# Altium schematic sheet 2022_AESK_UAV_Islemci.SchDoc: =ProjectName
size A3; Organization: AESK; Address1: Designed by:; Address3: FATİH CAN; Revision: 2022 v1; SheetNumber: 1; SheetTotal: 6
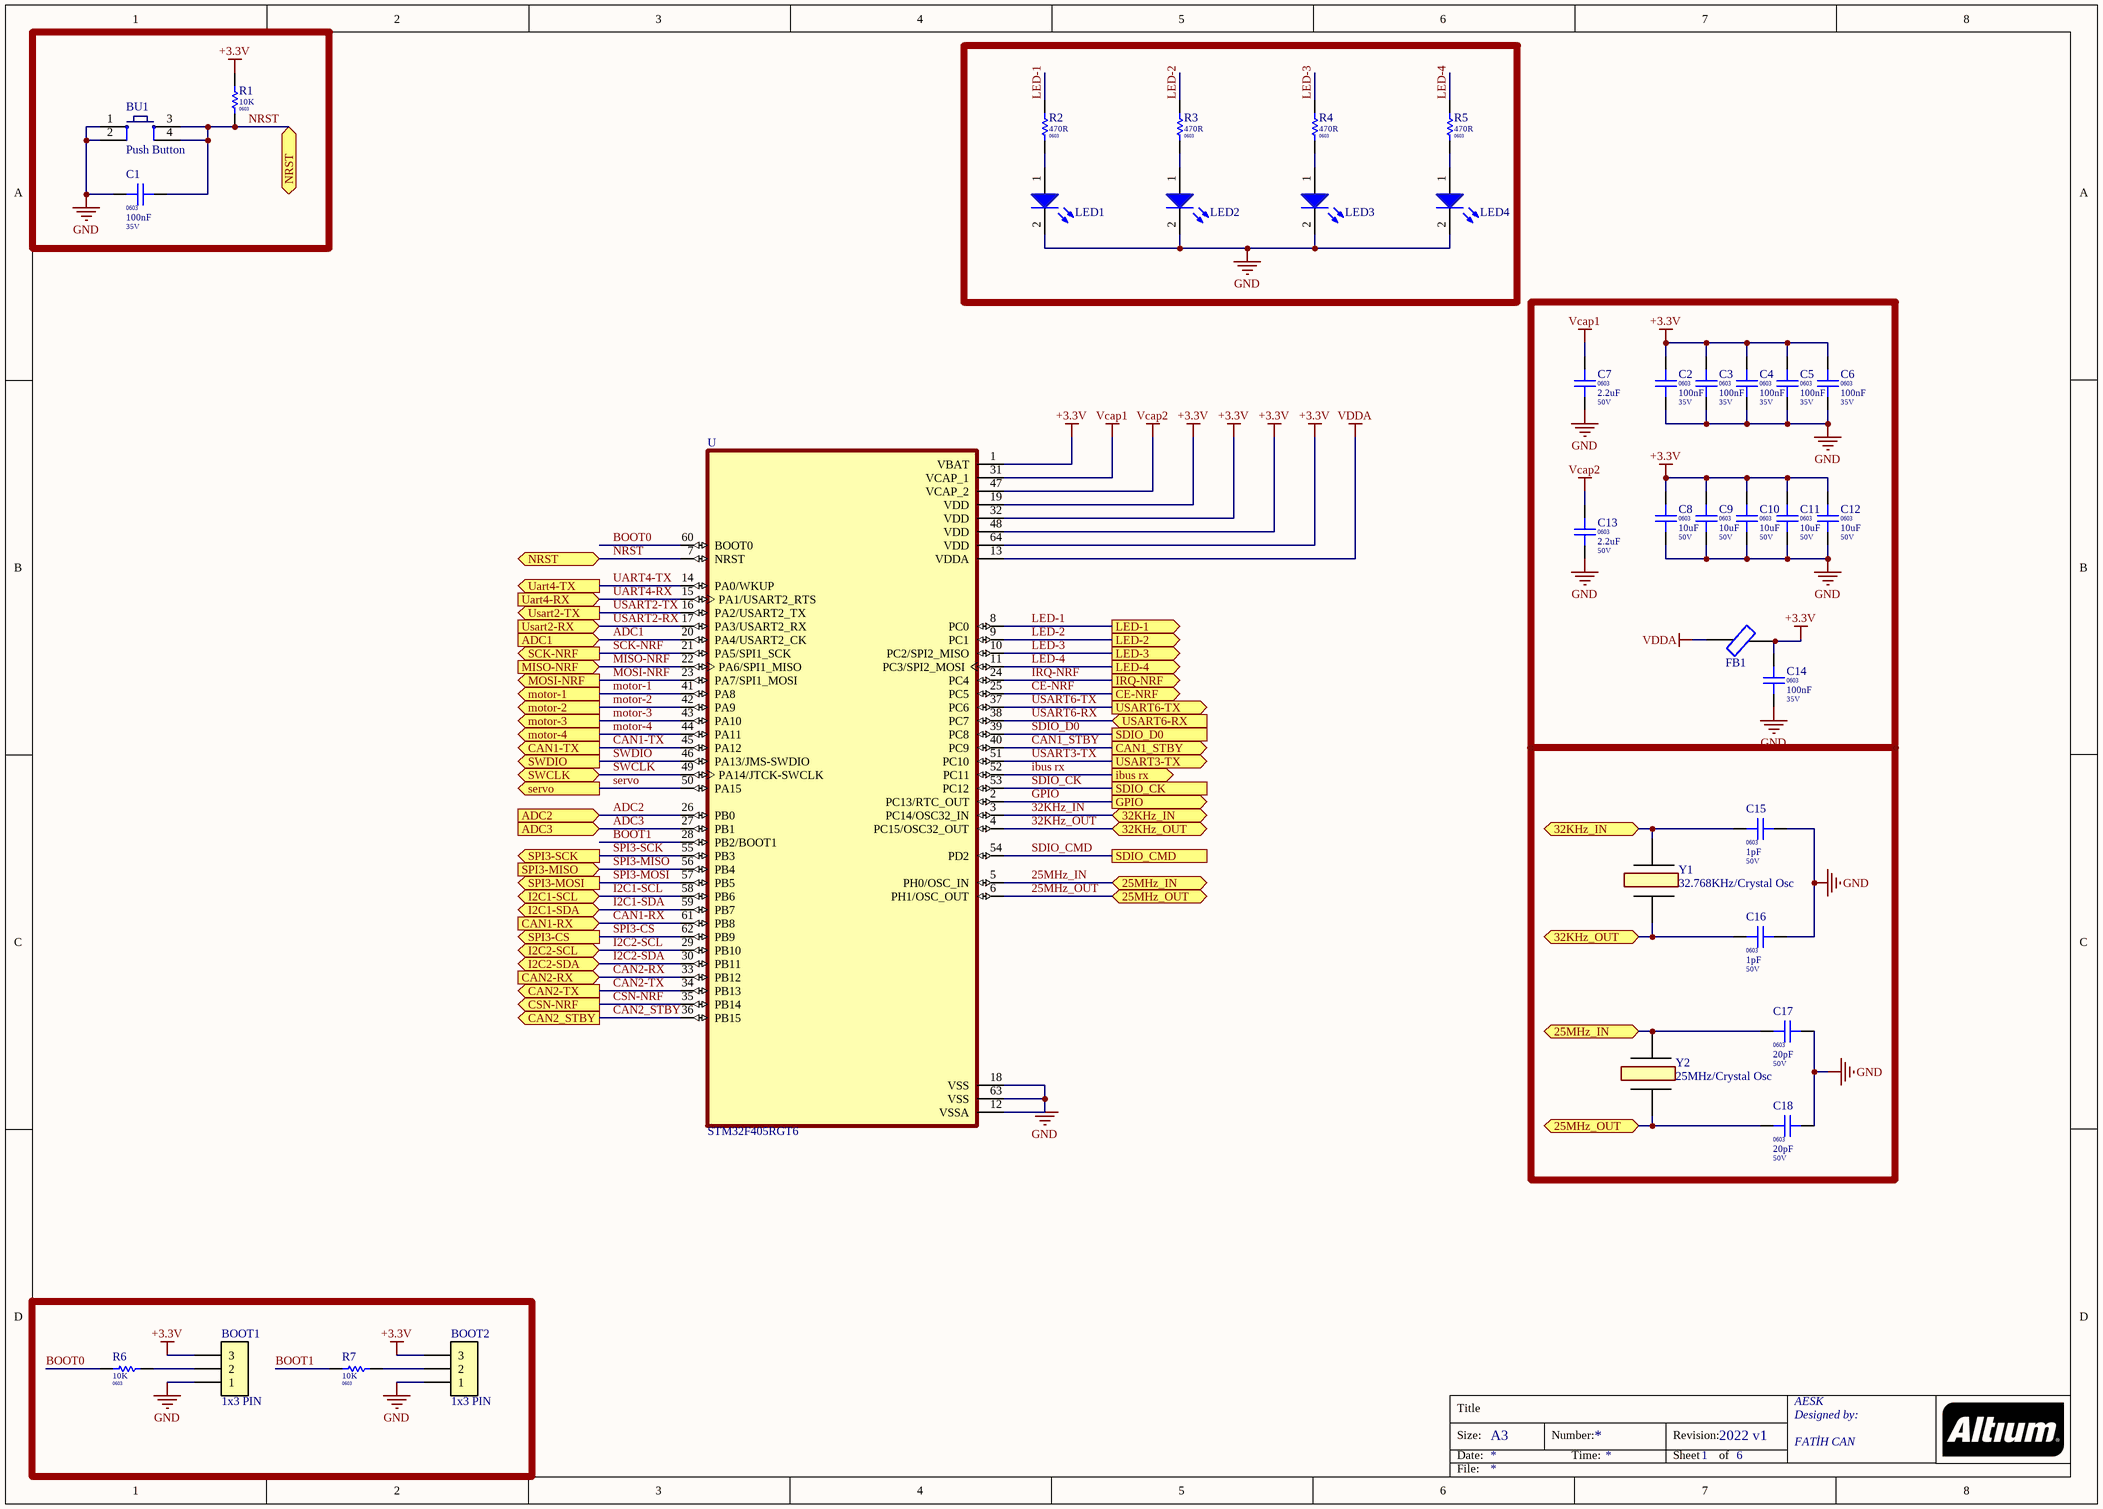
[diagram p0: 2022_AESK_UAV_Islemci.SchDoc]

## Parts
BOOT1  1x3 PIN  [HDR_2.54_1X3]
BOOT2  1x3 PIN  [HDR_2.54_1X3]
BU1  Push Button  [button son]
C1  Package / Case: 0603  Voltage: 35V  [CAPC 0603]  (hidden comment: 100nF)
C2  Package / Case: 0603  Voltage: 35V  [CAPC 0603]  (hidden comment: 100nF)
C3  Package / Case: 0603  Voltage: 35V  [CAPC 0603]  (hidden comment: 100nF)
C4  Package / Case: 0603  Voltage: 35V  [CAPC 0603]  (hidden comment: 100nF)
C5  Package / Case: 0603  Voltage: 35V  [CAPC 0603]  (hidden comment: 100nF)
C6  Package / Case: 0603  Voltage: 35V  [CAPC 0603]  (hidden comment: 100nF)
C7  Package / Case: 0603  Voltage: 50V  [CAPC 0603]  (hidden comment: 2.2uF)
C8  Package / Case: 0603  Voltage: 50V  [CAPC 0603]  (hidden comment: 10uF)
C9  Package / Case: 0603  Voltage: 50V  [CAPC 0603]  (hidden comment: 10uF)
C10  Package / Case: 0603  Voltage: 50V  [CAPC 0603]  (hidden comment: 10uF)
C11  Package / Case: 0603  Voltage: 50V  [CAPC 0603]  (hidden comment: 10uF)
C12  Package / Case: 0603  Voltage: 50V  [CAPC 0603]  (hidden comment: 10uF)
C13  Package / Case: 0603  Voltage: 50V  [CAPC 0603]  (hidden comment: 2.2uF)
C14  Package / Case: 0603  Voltage: 35V  [CAPC 0603]  (hidden comment: 100nF)
C15  Package / Case: 0603  Voltage: 50V  [CAPC 0603]  (hidden comment: 1pF)
C16  Package / Case: 0603  Voltage: 50V  [CAPC 0603]  (hidden comment: 1pF)
C17  Package / Case: 0603  Voltage: 50V  [CAPC 0603]  (hidden comment: 20pF)
C18  Package / Case: 0603  Voltage: 50V  [CAPC 0603]  (hidden comment: 20pF)
FB1  Ferrite Bead  [FCM1608KF-601T03]  (value not drawn)
LED1  (no value)  [LED BLUE 0603]
LED2  (no value)  [LED BLUE 0603]
LED3  (no value)  [LED BLUE 0603]
LED4  (no value)  [LED BLUE 0603]
R1  Package / Case: 0603  [RESC 0603]  (hidden comment: 10K)
R2  Package / Case: 0603  [RESC 0603]  (hidden comment: 470R)
R3  Package / Case: 0603  [RESC 0603]  (hidden comment: 470R)
R4  Package / Case: 0603  [RESC 0603]  (hidden comment: 470R)
R5  Package / Case: 0603  [RESC 0603]  (hidden comment: 470R)
R6  Package / Case: 0603  [RESC 0603]  (hidden comment: 10K)
R7  Package / Case: 0603  [RESC 0603]  (hidden comment: 10K)
U  STM32F405RGT6  [QFP50P1200X1200X160-64N]
Y1  32.768KHz/Crystal Osc  [32KhZ crystal oscillator]
Y2  25MHz/Crystal Osc  [25MHz Crystal Oscillator]

## Ports
25MHz_IN (bidir), 25MHz_OUT (bidir), 32KHz_IN (bidir), 32KHz_OUT (bidir), ADC1 (in), ADC2 (in), ADC3 (in), CAN1-RX (in), CAN1-TX (out), CAN1_STBY (out), CAN2-RX (in), CAN2-TX (out), CAN2_STBY (out), CE-NRF (out), CSN-NRF (out), GPIO (out), I2C1-SCL (bidir), I2C1-SDA (bidir), I2C2-SCL (bidir), I2C2-SDA (bidir), ibus rx (out), IRQ-NRF (out), LED-1 (out), LED-2 (out), LED-3 (out), LED-4 (out), MISO-NRF (in), MOSI-NRF (out), motor-1 (out), motor-2 (out), motor-3 (out), motor-4 (out), NRST (bidir), SCK-NRF (out), SDIO_CK, SDIO_CMD, SDIO_D0, servo (out), SPI3-CS (out), SPI3-MISO (in), SPI3-MOSI (out), SPI3-SCK (out), SWCLK (bidir), SWDIO (out), Uart4-RX (in), Uart4-TX (out), Usart2-RX (in), Usart2-TX (out), USART3-TX (out), USART6-RX (in), USART6-TX (out)

## Nets
+3.3V: BOOT1.3 BOOT2.3 C2.2 C3.2 C4.2 C5.2 C6.2 C8.2 C9.2 C10.2 C11.2 C12.2 C14.2 FB1.2 R1.1 U.1(VBAT) U.19(VDD) U.32(VDD) U.48(VDD) U.64(VDD)
GND: BOOT1.1 BOOT2.1 BU1.1 BU1.2 C1.1 C2.1 C3.1 C4.1 C5.1 C6.1 C7.1 C8.1 C9.1 C10.1 C11.1 C12.1 C13.1 C14.1 C15.2 C16.2 C17.2 C18.2 LED1.2(C) LED2.2(C) LED3.2(C) LED4.2(C) U.12(VSSA) U.18(VSS) U.63(VSS)
Vcap1: C7.2 U.31(VCAP_1)
Vcap2: C13.2 U.47(VCAP_2)
VDDA: FB1.1 U.13(VDDA)
25MHz_IN: C17.1 U.5(PH0/OSC_IN) Y2.2 ; port 25MHz_IN
25MHz_OUT: C18.1 U.6(PH1/OSC_OUT) Y2.1 ; port 25MHz_OUT
32KHz_IN: C15.1 U.3(PC14/OSC32_IN) Y1.2 ; port 32KHz_IN
32KHz_OUT: C16.1 U.4(PC15/OSC32_OUT) Y1.1 ; port 32KHz_OUT
ADC1: U.20(PA4/USART2_CK) ; port ADC1
ADC2: U.26(PB0) ; port ADC2
ADC3: U.27(PB1) ; port ADC3
BOOT0: R6.1 U.60(BOOT0)
BOOT1: R7.1 U.28(PB2/BOOT1)
CAN1-RX: U.61(PB8) ; port CAN1-RX
CAN1-TX: U.45(PA12) ; port CAN1-TX
CAN1_STBY: U.40(PC9) ; port CAN1_STBY
CAN2-RX: U.33(PB12) ; port CAN2-RX
CAN2-TX: U.34(PB13) ; port CAN2-TX
CAN2_STBY: U.36(PB15) ; port CAN2_STBY
CE-NRF: U.25(PC5) ; port CE-NRF
CSN-NRF: U.35(PB14) ; port CSN-NRF
GPIO: U.2(PC13/RTC_OUT) ; port GPIO
I2C1-SCL: U.58(PB6) ; port I2C1-SCL
I2C1-SDA: U.59(PB7) ; port I2C1-SDA
I2C2-SCL: U.29(PB10) ; port I2C2-SCL
I2C2-SDA: U.30(PB11) ; port I2C2-SDA
ibus rx: U.52(PC11) ; port ibus rx
IRQ-NRF: U.24(PC4) ; port IRQ-NRF
LED-1: R2.2 U.8(PC0) ; port LED-1
LED-2: R3.2 U.9(PC1) ; port LED-2
LED-3: R4.2 U.10(PC2/SPI2_MISO) ; port LED-3
LED-4: R5.2 U.11(PC3/SPI2_MOSI) ; port LED-4
MISO-NRF: U.22(PA6/SPI1_MISO) ; port MISO-NRF
MOSI-NRF: U.23(PA7/SPI1_MOSI) ; port MOSI-NRF
motor-1: U.41(PA8) ; port motor-1
motor-2: U.42(PA9) ; port motor-2
motor-3: U.43(PA10) ; port motor-3
motor-4: U.44(PA11) ; port motor-4
NRST: BU1.3 BU1.4 C1.2 R1.2 U.7(NRST) ; port NRST
SCK-NRF: U.21(PA5/SPI1_SCK) ; port SCK-NRF
SDIO_CK: U.53(PC12) ; port SDIO_CK
SDIO_CMD: U.54(PD2) ; port SDIO_CMD
SDIO_D0: U.39(PC8) ; port SDIO_D0
servo: U.50(PA15) ; port servo
SPI3-CS: U.62(PB9) ; port SPI3-CS
SPI3-MISO: U.56(PB4) ; port SPI3-MISO
SPI3-MOSI: U.57(PB5) ; port SPI3-MOSI
SPI3-SCK: U.55(PB3) ; port SPI3-SCK
SWCLK: U.49(PA14/JTCK-SWCLK) ; port SWCLK
SWDIO: U.46(PA13/JMS-SWDIO) ; port SWDIO
UART4-RX: U.15(PA1/USART2_RTS) ; port Uart4-RX
UART4-TX: U.14(PA0/WKUP) ; port Uart4-TX
USART2-RX: U.17(PA3/USART2_RX) ; port Usart2-RX
USART2-TX: U.16(PA2/USART2_TX) ; port Usart2-TX
USART3-TX: U.51(PC10) ; port USART3-TX
USART6-RX: U.38(PC7) ; port USART6-RX
USART6-TX: U.37(PC6) ; port USART6-TX
NetBOOT1_2: BOOT1.2 R6.2
NetBOOT2_2: BOOT2.2 R7.2
NetLED1_1: LED1.1(A) R2.1
NetLED2_1: LED2.1(A) R3.1
NetLED3_1: LED3.1(A) R4.1
NetLED4_1: LED4.1(A) R5.1

## Notes on the sheet
- Title
- Size:
- Date:
- A3
- Number:
- Time:
- Revision:
- Sheet
- of
- File:

## Library data of the parts
BOOT1 BOOT2 = Connector0009: Header 2.54 1x3; Part Number: Connector0009; Category: Connectors; Package / Case: HDR_2.54_1X3; Values: Header 2.54 1x3
BU1 = Push Button: Smd Push Button; Satın Alma Linki: https://urun.n11.com/diger/mini-pushbutton-switch-smd-P227461537?gclid=Cj0KCQjwkoDmBRCcARIsAG3xzl8Y_-jeD7HocNM6lvuZ_rVp83568XPGtNzlPwXWLph8oCRqo0yh87UaApZYEALw_wcB&gclsrc=aw.ds
C1-C6 C14 = CAPC0328: Capacitor Ceramic 100nF 35V 0603; Tolerance: %10; Value Rating: nF; Value: 100nF; Part Number: CAPC0328; Category: Capacitor Ceramic; Values: 100nF 35V
C7 C13 = CAPC0295: Capacitor Ceramic 2.2uF 50V 0603; Tolerance: %10; Value Rating: uF; Value: 2.2uF; Part Number: CAPC0295; Category: Capacitor Ceramic; Values: 2.2uF 50V
C8-C12 = CAPC0301: Capacitor Ceramic 10uF 50V 0603; Tolerance: %10; Value Rating: uF; Value: 10uF; Part Number: CAPC0301; Category: Capacitor Ceramic; Values: 10uF 50V
C15 C16 = CAPC0233: Capacitor Ceramic 1pF 50V 0603; Tolerance: %10; Value Rating: pF; Values: 1pF 50V; Value: 1pF; Part Number: CAPC0233; Category: Capacitor Ceramic
C17 C18 = CAPC0246: Capacitor Ceramic 20pF 50V 0603; Tolerance: %10; Value Rating: pF; Value: 20pF; Part Number: CAPC0246; Category: Capacitor Ceramic; Values: 20pF 50V
FB1 = FCM1608KF-601T03
LED1-LED4 = LED BLUE: LED
R1 R6 R7 = R0220: 10K 0603; Part Number: R0220; Tolerance: %5; Power: 1/10W; Value: 10K; Category: Resistor; Values: 10K
R2-R5 = R0188: 470R 0603; Part Number: R0188; Tolerance: %5; Power: 1/10W; Value: 470R; Category: Resistor; Values: 470R
U = STM32F405RGT6: ARMÂ® CortexÂ®-M4 STM32F4 Microcontroller IC 32-Bit 168MHz 1MB _1M x 8_ FLASH 64-LQFP _10x10_; MF: STMicroelectronics; Package: LQFP-64 STMicroelectronics; Digi-Key_Purchase_URL: https://www.digikey.com/product-detail/en/stmicroelectronics/STM32F405RGT6/497-11767-ND/2754208?utm_source=snapeda&utm_medium=aggregator&utm_campaign=symbol; Value: *; MP: STM32F405RGT6; SnapEDA_Link: https://www.snapeda.com/parts/STM32F405RGT6/STMicroelectronics/view-part/105502/?ref=snap; Digi-Key_Part_Number: 497-11767-ND
Y1 = NX3215SA-32.768KHZ-EXS00A-MU00525: Crystal or Oscillator; ComponentLink1Description: New link; ComponentLink1URL: *
Y2 = ECS-250-18-5PX-F-TR: Crystal or Oscillator